# EAGLE design Motor-Control-With-Password (EAGLE 6.3)
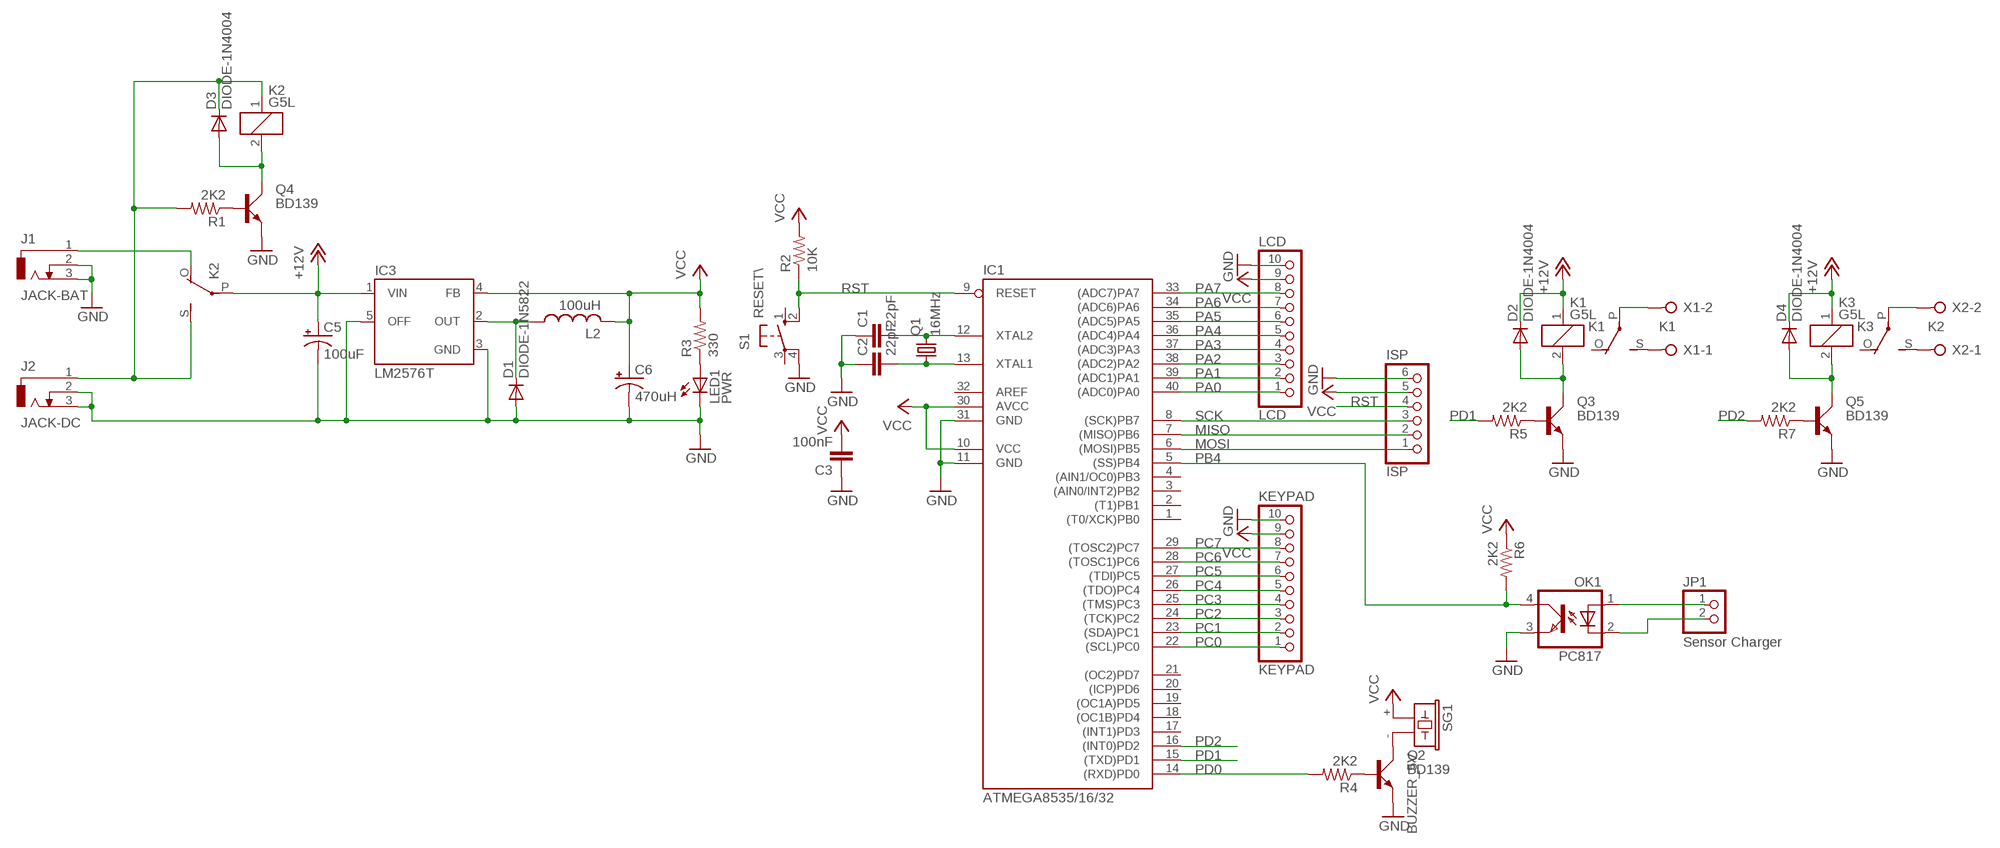
[diagram p0: schematic, sheet 1]

## Parts
C1  22pF  CAPACITOR-NONPOLAR025-024X044  [C025-024X044]
C2  22pF  CAPACITOR-NONPOLAR025-024X044  [C025-024X044]
C3  100nF  CAPACITOR-NONPOLAR025-024X044  [C025-024X044]
C5  100uF  CAPACITOR-POLARE2.5-6  [E2,5-6]
C6  470uH  CAPACITOR-POLARE3.5-8  [E3,5-8]
D1  DIODE-1N5822  [DO201-15]
D2  DIODE-1N4004  [DO41-10]
D3  DIODE-1N4004  [DO41-10]
D4  DIODE-1N4004  [DO41-10]
IC1  ATMEGA8535/16/32  [DIL40]
IC3  LM2576T  [TO220-5]
ISP  ISP  PINHD-1X6  [1X06]
J1  JACK-BAT  JACK-DC  [DCJ0202]
J2  JACK-DC  [DCJ0202]
JP1  Sensor Charger  PINHD-1X2  [1X02]
K1  G5L  [G5LE]
K2  G5L  [G5LE]
K3  G5L  [G5LE]
KEYPAD  KEYPAD  PINHD-1X10  [1X10]
L2  100uH  INDUCTORTJ3-U2  [TJ3-U2]
LCD  LCD  PINHD-1X10  [1X10]
LED1  PWR  LED3MM  [LED3MM]
OK1  PC817  [DIL04]
Q1  16MHz  CRYSTALHC49S  [HC49/S]
Q2  BD139  [TO126AV]
Q3  BD139  [TO126AV]
Q4  BD139  [TO126AV]
Q5  BD139  [TO126AV]
R1  2K2  RESISTOR0207/10  [0207/10]
R2  10K  RESISTOR0207/10  [0207/10]
R3  330  RESISTOR0207/10  [0207/10]
R4  2K2  RESISTOR0207/10  [0207/10]
R5  2K2  RESISTOR0207/10  [0207/10]
R6  2K2  RESISTOR0207/10  [0207/10]
R7  2K2  RESISTOR0207/10  [0207/10]
S1  RESET\  SW-PUSHBUTTON  [B3F-10XX]
SG1  BUZZER_5V  [BUZZER_F/CM12P]
X1  K1  W237-02P  [W237-132]
X2  K2  W237-02P  [W237-132]

## Nets
+12V: C5.+ D2.C D4.C IC3.1(VIN) K1.1 K2.P(2:P) K3.1
GND: C1.1 C2.1 C3.1 C5.- C6.- D1.A IC1.11(GND) IC1.31(GND) IC3.3(GND) IC3.5(OFF) ISP.6 J1.2 J1.3 J2.2 J2.3 KEYPAD.10 LCD.10 LED1.K(C) OK1.3(EMIT) Q2.E Q3.E Q4.E Q5.E S1.4(P1)
MISO: IC1.7((MISO)PB6) ISP.2
MOSI: IC1.6((MOSI)PB5) ISP.1
N$1: K1.S(2:S) X1.1
N$2: C1.2 IC1.12(XTAL2) Q1.2
N$3: C2.2 IC1.13(XTAL1) Q1.1
N$4: Q4.B R1.1
N$5: D3.A K2.2 Q4.C
N$6: D1.C IC3.2(OUT) L2.1
N$7: D3.C J2.1 K2.1 K2.S(2:S) R1.2
N$8: Q2.B R4.1
N$9: Q3.B R5.1
N$10: LED1.A R3.1
N$11: J1.1 K2.O(2:O)
N$12: JP1.1 OK1.1(A)
N$13: Q2.C SG1.-
N$14: D2.A K1.2 Q3.C
N$15: JP1.2 OK1.2(C)
N$17: K1.P(2:P) X1.2
N$19: Q5.B R7.1
N$20: D4.A K3.2 Q5.C
N$21: K3.S(2:S) X2.1
N$22: K3.P(2:P) X2.2
PA0: IC1.40((ADC0)PA0) LCD.1
PA1: IC1.39((ADC1)PA1) LCD.2
PA2: IC1.38((ADC2)PA2) LCD.3
PA3: IC1.37((ADC3)PA3) LCD.4
PA4: IC1.36((ADC4)PA4) LCD.5
PA5: IC1.35((ADC5)PA5) LCD.6
PA6: IC1.34((ADC6)PA6) LCD.7
PA7: IC1.33((ADC7)PA7) LCD.8
PB4: IC1.5((SS)PB4) OK1.4(COL) R6.2
PC0: IC1.22((SCL)PC0) KEYPAD.1
PC1: IC1.23((SDA)PC1) KEYPAD.2
PC2: IC1.24((TCK)PC2) KEYPAD.3
PC3: IC1.25((TMS)PC3) KEYPAD.4
PC4: IC1.26((TDO)PC4) KEYPAD.5
PC5: IC1.27((TDI)PC5) KEYPAD.6
PC6: IC1.28((TOSC1)PC6) KEYPAD.7
PC7: IC1.29((TOSC2)PC7) KEYPAD.8
PD0: IC1.14((RXD)PD0) R4.2
PD1: IC1.15((TXD)PD1) R5.2
PD2: IC1.16((INT0)PD2) R7.2
RST: IC1.9(RESET) ISP.4 R2.1 S1.2(S1)
SCK: IC1.8((SCK)PB7) ISP.3
VCC: C3.2 C6.+ IC1.10(VCC) IC1.30(AVCC) IC3.4(FB) ISP.5 KEYPAD.9 L2.2 LCD.9 R2.2 R3.2 R6.1 SG1.+
Unconnected: IC1.1((T0/XCK)PB0) IC1.2((T1)PB1) IC1.3((AIN0/INT2)PB2) IC1.4((AIN1/OC0)PB3) IC1.17((INT1)PD3) IC1.18((OC1B)PD4) IC1.19((OC1A)PD5) IC1.20((ICP)PD6) IC1.21((OC2)PD7) IC1.32(AREF) K1.O(2:O) K3.O(2:O) S1.1(S) S1.3(P)

## Library data of the parts
C1-C3 = barelang-store:CAPACITOR-NONPOLAR: CAPACITOR, European symbol
C5 C6 = barelang-store:CAPACITOR-POLAR: POLARIZED CAPACITOR, American symbol
D1 = barelang-store:DIODE-1N5822: DIODE standard rectifier, 3 A, 50 V (Motorola)
D2-D4 = barelang-store:DIODE-1N4004: DIODE general purpose rectifier, 1 A
IC1 = barelang-store:ATMEGA8535/16/32: MICROCONTROLLER 32 Kbytes FLASH 2 Kbytes SRAM 1 Kbytes EEPROM USART 8-channel 10 bit ADC Source: www.atmel.com .. doc2503.pdf; MPN: ATMEGA32-16PU; OC_FARNELL: 1661729; OC_NEWARK: 51P1794
IC3 = barelang-store:LM2576: National Semiconductor <http://www.national.com> 3.0A "Simple Switcher"(c) 52kHz, Vout 1.23-37V (HV: 57V), Vin 40V (HV: 60V), 50µA standby current
ISP = barelang-store:PINHD-1X6: PIN HEADER
J1 J2 = barelang-store:JACK-DC: DC POWER JACK Source: DCJ0202.pdf; OC_FARNELL: unknown; OC_NEWARK: unknown
JP1 = barelang-store:PINHD-1X2: PIN HEADER
K1-K3 = relay:G5L: RELAY 1 x switch, 10 A/120 V AC, 8 A/30 V ADC, Omron; OC_FARNELL: unknown; OC_NEWARK: unknown
KEYPAD LCD = barelang-store:PINHD-1X10: PIN HEADER
L2 = barelang-store:INDUCTOR: INDUCTOR, American symbol
LED1 = barelang-store:LED: LED OSRAM: - CHIPLED LG R971, LG N971, LY N971, LG Q971, LY Q971, LO R971, LY R971 LH N974, LH R974 LS Q976, LO Q976, LY Q976 LO Q996 - Hyper CHIPLED LW Q18S LB Q993, LB Q99A, LB R99A - SideLED LS A670, LO A670, LY A670, LG A670, LP A670 LB A673, LV A673, LT A673, LW A673 LH A674 LY A675 LS A676, LA A676, LO A676, LY A676, LW A676 LS A679, LY A679, LG A679 - Hyper Micro SIDELED® LS Y876, LA Y876, LO Y876, LY Y876 LT Y87S - SmartLED LW L88C, LW L88S LB L89C, LB L89S, LG L890 LS L89K, LO L89K, LY L89K LS L896, LA L896, LO L896, LY L896 - TOPLED LS T670, LO T670, LY T670, LG T670, LP T670 LSG T670, LSP T670, LSY T670, LOP T670, LYG T670 LG T671, LOG T671, LSG T671 LB T673, LV T673, LT T673, LW T673 LH T674 LS T676, LA T676, LO T676, LY T676, LB T676, LH T676, LSB T676, LW T676 LB T67C, LV T67C, LT T67C, LS T67K, LO T67K, LY T67K, LW E67C LS E67B, LA E67B, LO E67B, LY E67B, LB E67C, LV E67C, LT E67C LW T67C LS T679, LY T679, LG T679 LS T770, LO T770, LY T770, LG T770, LP T770 LB T773, LV T773, LT T773, LW T773 LH T774 LS E675, LA E675, LY E675, LS T675 LS T776, LA T776, LO T776, LY T776, LB T776 LHGB T686 LT T68C, LB T68C - Hyper Mini TOPLED® LB M676 - Mini TOPLED Santana® LG M470 LS M47K, LO M47K, LY M47K Source: http://www.osram.convergy.de LUXEON: - LUMILED® LXK2-PW12-R00, LXK2-PW12-S00, LXK2-PW14-U00, LXK2-PW14-V00 LXK2-PM12-R00, LXK2-PM12-S00, LXK2-PM14-U00 LXK2-PE12-Q00, LXK2-PE12-R00, LXK2-PE12-S00, LXK2-PE14-T00, LXK2-PE14-U00 LXK2-PB12-K00, LXK2-PB12-L00, LXK2-PB12-M00, LXK2-PB14-N00, LXK2-PB14-P00, LXK2-PB14-Q00 LXK2-PR12-L00, LXK2-PR12-M00, LXK2-PR14-Q00, LXK2-PR14-R00 LXK2-PD12-Q00, LXK2-PD12-R00, LXK2-PD12-S00 LXK2-PH12-R00, LXK2-PH12-S00 LXK2-PL12-P00, LXK2-PL12-Q00, LXK2-PL12-R00 Source: www.luxeon.com KINGBRIGHT: KA-3528ASYC Source: www.kingbright.com
OK1 = barelang-store:PC817: SHARP OPTO COUPLER; MPN: PC817X4J000F; OC_FARNELL: 9707727; OC_NEWARK: 97K7059
Q1 = barelang-store:CRYSTAL: CRYSTAL; OC_FARNELL: 1667008; OC_NEWARK: unknown
Q2-Q5 = barelang-store:BD139: NPN TRANSISTOR
R1-R7 = barelang-store:RESISTOR: RESISTOR, American symbol
S1 = barelang-store:SW-PUSHBUTTON: OMRON SWITCH; MPN: B3F-1000; OC_FARNELL: 176432; OC_NEWARK: 36M3542
SG1 = barelang-store:BUZZER_5V: BUZZER Source: Buerklin; OC_FARNELL: unknown; OC_NEWARK: unknown
X1 X2 = con-wago-508:W237-02P: WAGO SREW CLAMP; OC_FARNELL: unknown; OC_NEWARK: unknown

## Board
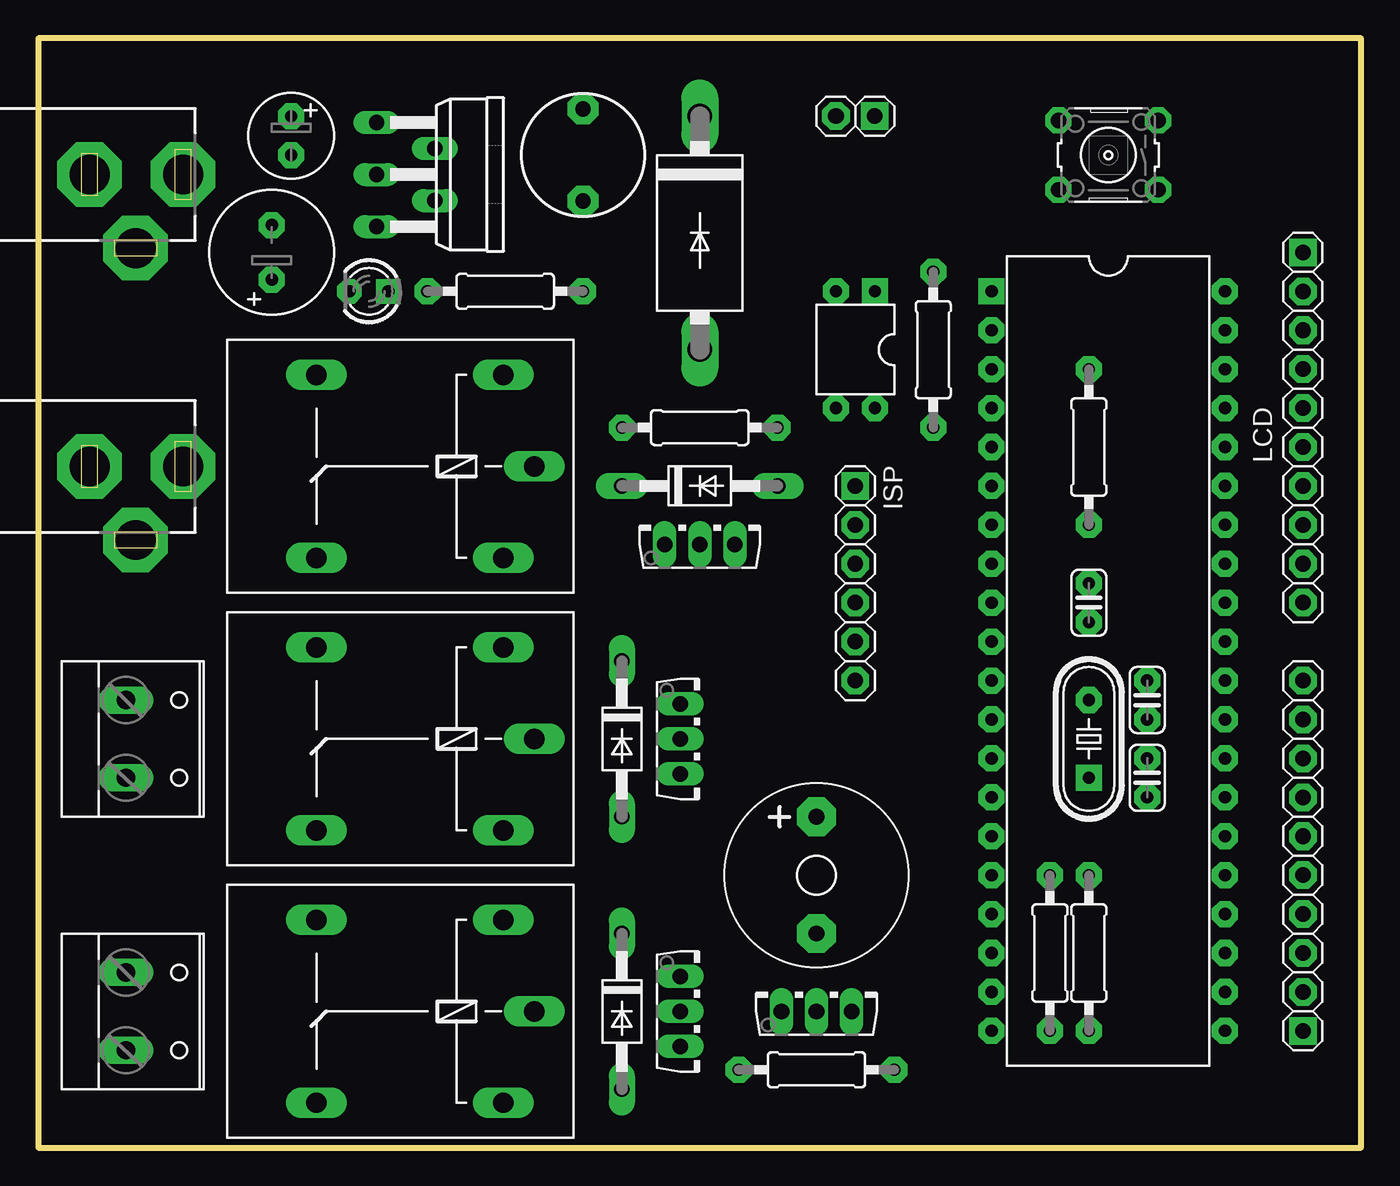
[diagram p1: board, top side]
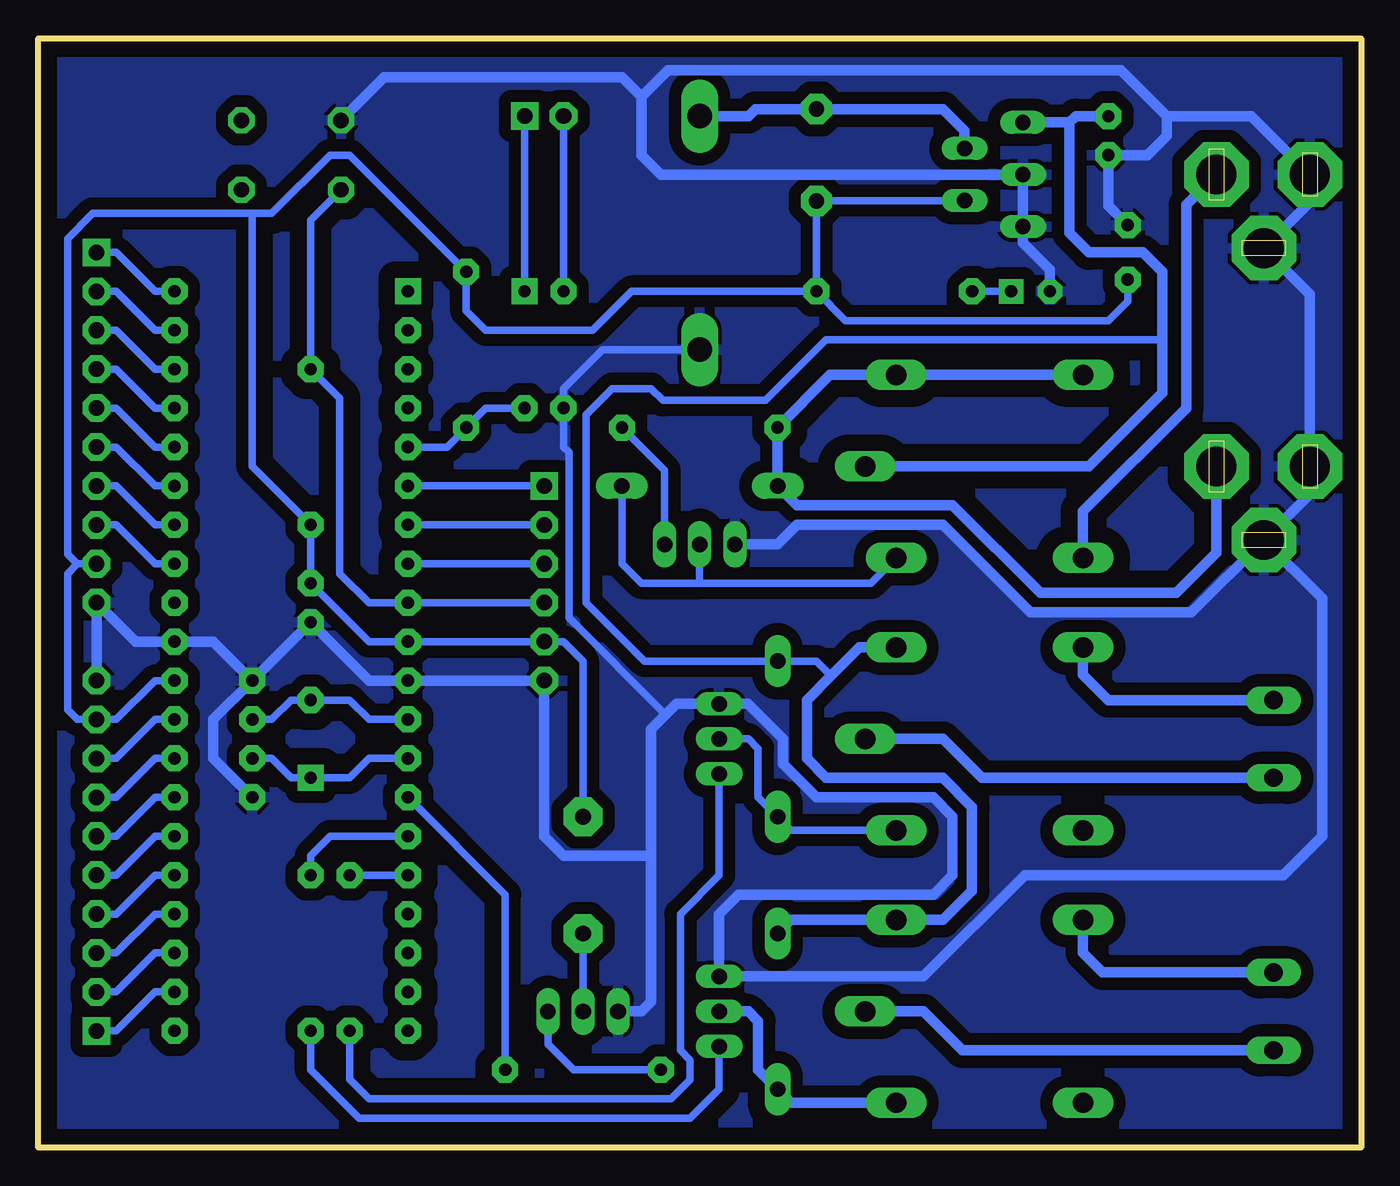
[diagram p2: board, bottom side, seen from below]

Size 86.36 x 72.39 mm. Coordinates in mm from the lower left corner, seen from the top.
Outline: 0,0 86.36,0 86.36,72.39 0,72.39 0,0
Copper layers (1*16): Top 0.035mm / dielectric 1.5mm / Bottom 0.035mm
Design rules "default *": minimum track width 0.3mm, minimum drill 0.8mm, track to track 10mil, track to pad 10mil, pad to pad 10mil, via to via 10mil, smd to smd 8mil, copper to edge 40mil, drill to drill 8mil, minimum pad ring 10mil, minimum via ring 8mil, stop-mask expansion 4mil, vias tented up to drill 0mil, thermal gap 10mil

### Footprints (pad centres in the part's own frame; a part is rotated, then mirrored left to right if it is on the bottom)
C025-024X044 = drill 0.8 pad 1.7 octagon: 1 -1.27,0; 2 1.27,0
E2,5-6 = drill 0.8 pad 1.7 octagon: + -1.27,0; - 1.27,0
E3,5-8 = drill 0.813 pad 1.7 octagon: + -1.778,0; - 1.778,0
DO201-15 = drill 1.6 long: A 7.62,0; C -7.62,0
DO41-10 = drill 1 pad 1.7 long: A 5.08,0; C -5.08,0
DIL40 = drill 0.8 pad 1.7 square: 1 -24.13,-7.62 | drill 0.8 pad 1.7 octagon: 2 -21.59,-7.62; 3 -19.05,-7.62; 4 -16.51,-7.62; 5 -13.97,-7.62; 6 -11.43,-7.62; 7 -8.89,-7.62; 8 -6.35,-7.62; 9 -3.81,-7.62; 10 -1.27,-7.62; 11 1.27,-7.62; 12 3.81,-7.62; 13 6.35,-7.62; 14 8.89,-7.62; 15 11.43,-7.62; 16 13.97,-7.62; 17 16.51,-7.62; 18 19.05,-7.62; 19 21.59,-7.62; 20 24.13,-7.62; 21 24.13,7.62; 22 21.59,7.62; 23 19.05,7.62; 24 16.51,7.62; 25 13.97,7.62; 26 11.43,7.62; 27 8.89,7.62; 28 6.35,7.62; 29 3.81,7.62; 30 1.27,7.62; 31 -1.27,7.62; 32 -3.81,7.62; 33 -6.35,7.62; 34 -8.89,7.62; 35 -11.43,7.62; 36 -13.97,7.62; 37 -16.51,7.62; 38 -19.05,7.62; 39 -21.59,7.62; 40 -24.13,7.62
TO220-5 = drill 1 long: 1 -3.4,-8.4; 2 -1.7,-4.59; 3 0,-8.4; 4 1.7,-4.59; 5 3.4,-8.4
1X06 = drill 1.016 pad 1.8 square: 1 -6.35,0 | drill 1.016 pad 1.8 octagon: 2 -3.81,0; 3 -1.27,0; 4 1.27,0; 5 3.81,0; 6 6.35,0
DCJ0202 = drill 2.6 pad 4.2 octagon: 1 0,3.1; 2 4.8,0; 3 0,-3
1X02 = drill 1.016 pad 1.8 square: 1 -1.27,0 | drill 1.016 pad 1.8 octagon: 2 1.27,0
G5LE = drill 1.321 long: 1 -7.493,-5.969; 2 -7.493,5.969; O 4.699,5.969; P -9.525,0; S 4.699,-5.969
1X10 = drill 1.016 pad 1.8 square: 1 -11.43,0 | drill 1.016 pad 1.8 octagon: 2 -8.89,0; 3 -6.35,0; 4 -3.81,0; 5 -1.27,0; 6 1.27,0; 7 3.81,0; 8 6.35,0; 9 8.89,0; 10 11.43,0
TJ3-U2 = drill 1 pad 2 octagon: 1 -3,0; 2 3,0
LED3MM = drill 0.8 pad 1.6 square: A -1.27,0 | drill 0.8 pad 1.6 octagon: K 1.27,0
DIL04 = drill 0.8 pad 1.7 square: 1 -1.27,-3.81 | drill 0.8 pad 1.7 octagon: 2 1.27,-3.81; 3 1.27,3.81; 4 -1.27,3.81
HC49/S = drill 0.8 pad 1.7 square: 1 -2.54,0 | drill 0.8 pad 1.7 octagon: 2 2.54,0
TO126AV = drill 1.016 long: B 2.286,-1.27; C 0,-1.27; E -2.286,-1.27
0207/10 = drill 0.8 pad 1.7 octagon: 1 -5.08,0; 2 5.08,0
B3F-10XX = drill 1 pad 1.7 octagon: 1 -3.251,2.261; 2 3.251,2.261; 3 -3.251,-2.261; 4 3.251,-2.261
BUZZER_F/CM12P = drill 1.016 pad 2.54 octagon: + 3.81,0; - -3.81,0
W237-132 = drill 1.194 long: 1 -2.54,-0.635; 2 2.54,-0.635

### Placement (x,y rotation side)
C1  72.39,29.21 270 top
C2  72.39,24.13 90 top
C3  68.58,35.56 90 top
C5  16.51,66.04 270 top
C6  15.24,58.42 90 top
D1  43.18,59.69 270 top
D2  38.1,8.89 270 top
D3  43.18,43.18 0 top
D4  38.1,26.67 270 top
IC1  69.85,31.75 270 top
IC3  30.48,63.5 270 top
ISP  53.34,36.83 270 top
J1  6.35,63.5 270 top
J2  6.35,44.45 270 top
JP1  53.34,67.31 180 top
K1  22.86,8.89 180 top
K2  22.86,44.45 180 top
K3  22.86,26.67 180 top
KEYPAD  82.55,19.05 90 top
L2  35.56,64.77 270 top
LCD  82.55,46.99 270 top
LED1  21.59,55.88 180 top
OK1  53.34,52.07 180 top
Q1  68.58,26.67 90 top
Q2  50.8,10.16 0 top
Q3  43.18,8.89 270 top
Q4  43.18,40.64 0 top
Q5  43.18,26.67 270 top
R1  43.18,46.99 180 top
R2  68.58,45.72 270 top
R3  30.48,55.88 0 top
R4  50.8,5.08 0 top
R5  68.58,12.7 90 top
R6  58.42,52.07 270 top
R7  66.04,12.7 90 top
S1  69.85,64.77 180 top
SG1  50.8,17.78 90 top
X1  6.35,8.89 270 top
X2  6.35,26.67 270 top

### Tracks (layer width: path | path; a pad name or v marks a point on that pad's centre or on a via)
+12V
  Bottom 0.5: 12.98,52.71 34.92,52.71 38.88,48.76 45.58,48.76 46.35,49.53 48.89,49.53 50.59,47.84 50.59,35.56 46.78,31.75 D4.C 35.56,31.75 34.61,30.8
  Bottom 0.7: 19.05,66.9 19.05,59.69 17.78,58.42 14.25,58.42 12.98,57.15 12.98,52.71 12.98,49.25 17.78,44.45 K2.P | 19.05,66.9 18.64,67.31 C5.+ | 19.05,66.9 IC3.1 | D2.C 37.21,14.86 K1.1 27.3,14.86 25.4,16.76 25.4,22.22 27.3,24.13 34.92,24.13 36.2,25.4 36.2,29.21 34.61,30.8 32.77,32.64 K3.1
GND
  Bottom 0.5: D1.A 49.53,52.07 52.07,49.53 OK1.3 52.07,45.72 51.71,45.36 51.71,34.57 45.4,28.26
  Bottom 0.7: J2.2 2.54,35.84 2.54,20.32 5.08,17.78 21.97,17.78 28.57,11.18 Q3.E 41.91,15.24 40.64,16.51 27.94,16.51 26.67,17.78 26.67,21.59 27.94,22.86 35.56,22.86 37.75,25.05 37.75,26.67 40.04,28.96 Q5.E 44.7,28.96 45.4,28.26 46.35,27.3 46.35,19.05 | 46.99,68.58 46.99,64.77 45.72,63.5 IC3.3 IC3.5 22.08,59.05 20.32,57.3 LED1.K | 46.99,68.58 45.26,70.31 15.7,70.31 12.7,67.31 | 46.99,68.58 48.26,69.85 63.78,69.85 S1.4 | 12.7,67.31 7.16,67.31 J1.3 3.35,61.7 J1.2 3.35,55.7 J2.3 3.35,42.65 J2.2 | C1.1 74.93,27.94 74.93,25.4 C2.1 | C1.1 74.93,33.02 IC1.31 80.01,33.02 LCD.10 KEYPAD.10 | 12.7,67.31 12.7,66.04 13.97,64.77 C5.- 16.51,61.47 C6.- | C1.1 C3.1 64.77,30.48 IC1.11 ISP.6 53.34,20.32 52.07,19.05 46.35,19.05 | Q2.E 46.99,8.89 46.35,9.53 46.35,19.05 | Q4.E 38.1,39.37 36.83,40.64 27.3,40.64 21.59,34.93 11.07,34.93 J2.2
  pour Bottom (isolate 0.8): 0,0 86.36,0 86.36,72.39 0,72.39
MISO
  Bottom 0.5: ISP.2 IC1.7
MOSI
  Bottom 0.5: ISP.1 IC1.6
N$1
  Bottom 0.7: K1.S 18.16,12.7 16.89,11.43 X1.1
N$2
  Bottom 0.5: IC1.12 64.77,27.94 66.04,29.21 Q1.2 69.85,29.21 71.12,27.94 C1.2
N$3
  Bottom 0.5: IC1.13 64.77,25.4 66.04,24.13 Q1.1 69.85,24.13 71.12,25.4 C2.2
N$4
  Bottom 0.5: R1.1 45.47,44.2 Q4.B
N$5
  Bottom 0.5: D3.A 48.26,38.1 46.99,36.83 43.18,36.83 | 43.18,36.83 Q4.C | K2.2 32,36.83 43.18,36.83
N$6
  Bottom 0.7: D1.C 40.01,67.31 39.55,67.77 L2.1 27.3,67.77 25.89,66.35 IC3.2
N$7
  Bottom 0.7: K2.S K2.1 34.67,50.42 R1.2 D3.C 36.83,41.91 26.67,41.91 20.95,36.2 12.07,36.2 9.45,38.81 J2.1
N$8
  Bottom 0.5: R4.1 51.44,5.08 53.09,6.73 Q2.B
N$9
  Bottom 0.5: Q3.B 41.91,3.81 43.81,1.91 65.41,1.91 68.58,5.08 R5.1
N$10
  Bottom 0.5: R3.1 LED1.A
N$11
  Bottom 0.7: K2.O 18.16,41.53 11.43,48.26 11.43,61.52 J1.1
N$12
  Bottom 0.5: JP1.1 OK1.1
N$13
  Bottom 0.5: SG1.- Q2.C
N$14
  Bottom 0.7: Q3.C 40.01,8.89 39.37,8.26 39.37,5.08 D2.A 37.21,2.92 K1.2
N$15
  Bottom 0.5: JP1.2 OK1.2
N$16
  pour Bottom (isolate 1.1): 0,72.39 86.36,72.39 86.36,0 0,0
N$17
  Bottom 0.7: X1.2 26.04,6.35 28.57,8.89 K1.P
N$19
  Bottom 0.5: Q5.B 41.91,17.78 44.45,15.24 44.45,6.35 43.81,5.71 43.81,4.43 45.07,3.17 64.77,3.17 66.04,4.45 R7.1
N$20
  Bottom 0.5: K3.2 37.21,20.7 D4.A 39.37,22.86 39.37,26.04 40.01,26.67 Q5.C
N$21
  Bottom 0.7: X2.1 16.51,29.21 18.16,30.86 K3.S
N$22
  Bottom 0.7: K3.P 27.3,26.67 24.77,24.13 X2.2
PA0
  Bottom 0.5: IC1.40 78.74,55.88 81.28,58.42 LCD.1
PA1
  Bottom 0.5: IC1.39 78.74,53.34 81.28,55.88 LCD.2
PA2
  Bottom 0.5: IC1.38 78.74,50.8 81.28,53.34 LCD.3
PA3
  Bottom 0.5: IC1.37 78.74,48.26 81.28,50.8 LCD.4
PA4
  Bottom 0.5: IC1.36 78.74,45.72 81.28,48.26 LCD.5
PA5
  Bottom 0.5: IC1.35 78.74,43.18 81.28,45.72 LCD.6
PA6
  Bottom 0.5: IC1.34 78.74,40.64 81.28,43.18 LCD.7
PA7
  Bottom 0.5: IC1.33 78.74,38.1 81.28,40.64 LCD.8
PB4
  Bottom 0.5: OK1.4 57.15,48.26 R6.2 59.69,45.72 IC1.5
PC0
  Bottom 0.5: IC1.22 78.74,10.16 81.28,7.62 KEYPAD.1
PC1
  Bottom 0.5: IC1.23 78.74,12.7 81.28,10.16 KEYPAD.2
PC2
  Bottom 0.5: IC1.24 78.74,15.24 81.28,12.7 KEYPAD.3
PC3
  Bottom 0.5: IC1.25 78.74,17.78 81.28,15.24 KEYPAD.4
PC4
  Bottom 0.5: IC1.26 78.74,20.32 81.28,17.78 KEYPAD.5
PC5
  Bottom 0.5: IC1.27 78.74,22.86 81.28,20.32 KEYPAD.6
PC6
  Bottom 0.5: IC1.28 78.74,25.4 81.28,22.86 KEYPAD.7
PC7
  Bottom 0.5: IC1.29 78.74,27.94 81.28,25.4 KEYPAD.8
PD0
  Bottom 0.5: R4.2 55.88,16.51 IC1.14
PD1
  Bottom 0.5: IC1.15 67.31,20.32 68.58,19.05 R5.2
PD2
  Bottom 0.5: IC1.16 R7.2
RST
  Bottom 0.5: S1.2 68.58,60.53 R2.1 66.68,48.9 66.68,37.47 64.77,35.56 IC1.9 ISP.4
SCK
  Bottom 0.5: ISP.3 IC1.8
VCC
  Bottom 0.3: 35.53,61.8 L2.2
  Bottom 0.5: R3.2 47.62,55.88 50.16,53.34 57.15,53.34 58.42,54.61 R6.1 66.04,64.77 67.31,64.77 71.12,60.96 72.39,60.96 | SG1.+ 50.8,31.75 52.07,33.02 ISP.5 IC1.10 64.77,33.02 C3.2 R2.2 72.39,44.45 72.39,60.96 | L2.2 R3.2 | 72.39,60.96 82.81,60.96 84.46,59.32 84.46,38.74 83.82,38.1 | IC1.30 78.74,30.48 81.28,27.94 KEYPAD.9 83.82,27.94 84.46,28.57 84.46,37.47 83.82,38.1 | 83.82,38.1 LCD.9 | C6.+ 15.24,55.25 16.51,53.98 33.66,53.98 R3.2 | IC3.4 35.53,61.8